# EAGLE design Circuito (EAGLE 8.2.0)
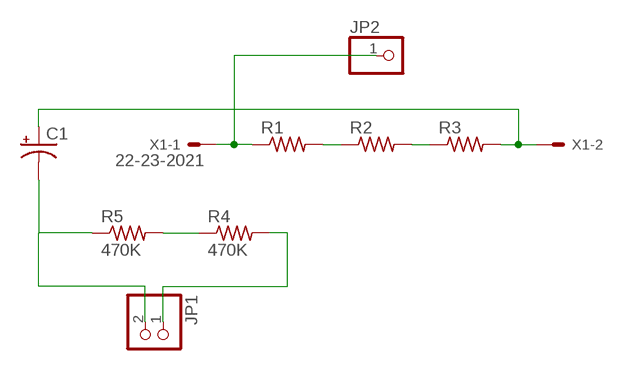
[diagram p0: schematic, sheet 1]

## Parts
C1  CPOL-USE2.5-7  [E2,5-7]
JP1  PINHD-1X2  [1X02]
JP2  PINHD-1X1  [1X01]
R1  R-US_0204/7  [0204/7]
R2  R-US_0204/7  [0204/7]
R3  R-US_0204/7  [0204/7]
R4  470K  R-US_0204/7  [0204/7]
R5  470K  R-US_0204/7  [0204/7]
X1  22-23-2021  [22-23-2021]

## Nets
N$1: C1.- JP1.2 R5.1
N$2: R4.1 R5.2
N$3: R1.2 R2.1
N$4: R2.2 R3.1
N$5: JP2.1 R1.1 X1.1
N$6: C1.+ R3.2 X1.2
N$9: JP1.1 R4.2

## Library data of the parts
C1 = rcl:CPOL-US: POLARIZED CAPACITOR, American symbol
JP1 = pinhead:PINHD-1X2: PIN HEADER
JP2 = pinhead:PINHD-1X1: PIN HEADER
R1-R3 = resistor:R-US_: RESISTOR, American symbol
R4 R5 = rcl:R-US_: RESISTOR, American symbol
X1 = con-molex:22-23-2021: .100" (2.54mm) Center Header - 2 Pin; MF: MOLEX; MPN: 22-23-2021; OC_FARNELL: 1462926; OC_NEWARK: 25C3832

## Board
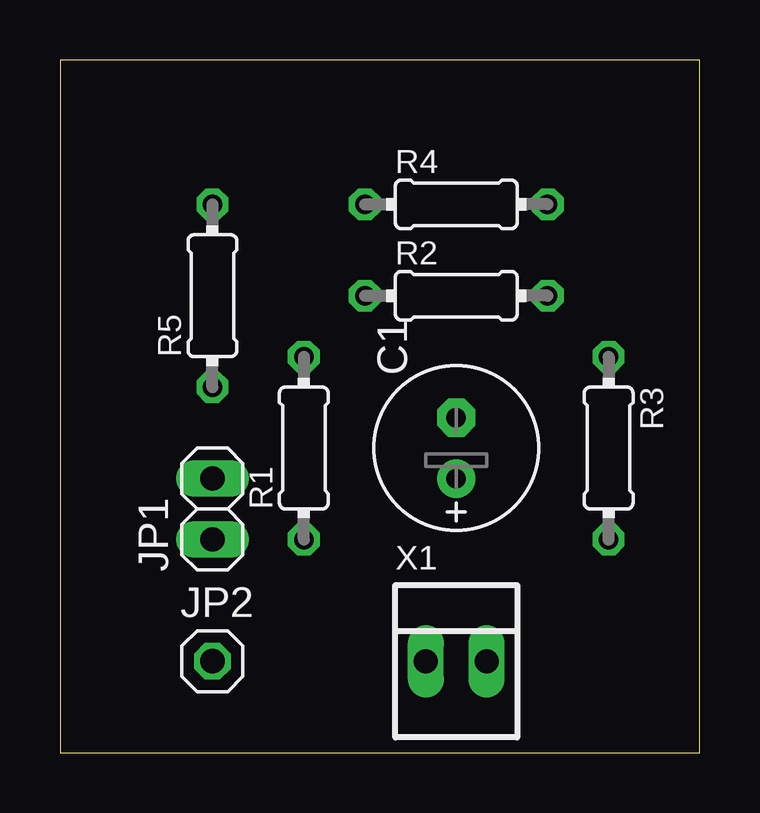
[diagram p1: board, top side]
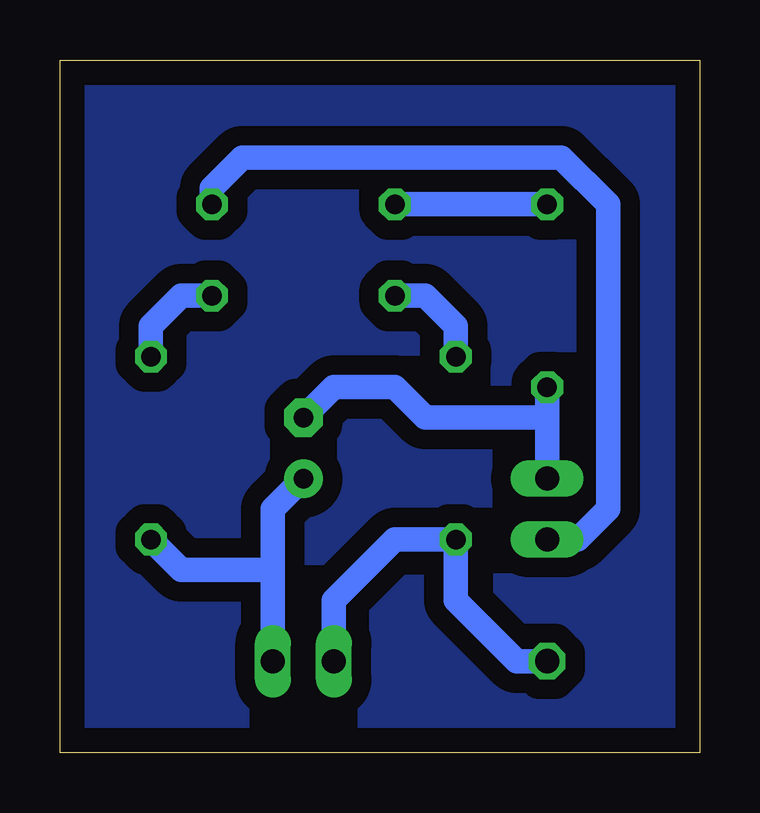
[diagram p2: board, bottom side, seen from below]

Size 26.65 x 28.88 mm. Coordinates in mm from the lower left corner, seen from the top.
Outline: 0,0 26.65,0 26.65,28.88 0,28.88 0,0
Copper layers (1*16): Top 0.035mm / dielectric 1.5mm / Bottom 0.035mm
Design rules "default": minimum track width 6mil, minimum drill 0.35mm, track to track 6mil, track to pad 6mil, pad to pad 6mil, via to via 6mil, smd to smd 6mil, copper to edge 40mil, drill to drill 6mil, minimum pad ring 10mil, minimum via ring 8mil, stop-mask expansion 4mil, vias tented up to drill 0mil, thermal gap 10mil

### Footprints (pad centres in the part's own frame; a part is rotated, then mirrored left to right if it is on the bottom)
E2,5-7 = drill 0.813 pad 1.6: + -1.27,0 | drill 0.813 pad 1.6 octagon: - 1.27,0
1X02 = drill 1.016 long: 1 -1.27,0; 2 1.27,0
1X01 = drill 1.016 octagon: 1 0,0
0204/7 = drill 0.813 octagon: 1 -3.81,0; 2 3.81,0
22-23-2021 = drill 1 long: 1 -1.27,0; 2 1.27,0

### Placement (x,y rotation side)
C1  16.51,12.7 90 top
JP1  6.35,10.16 90 top
JP2  6.35,3.81 0 top
R1  10.16,12.7 90 top
R2  16.51,19.05 0 top
R3  22.86,12.7 270 top
R4  16.51,22.86 0 top
R5  6.35,19.05 90 top
X1  16.51,3.81 0 top

### Tracks (layer width: path | path; a pad name or v marks a point on that pad's centre or on a via)
N$1
  Bottom 1.016: 6.35,13.97 R5.1 | 6.35,13.97 JP1.2 | C1.- 15.24,15.24 12.7,15.24 11.43,13.97 6.35,13.97
N$2
  Bottom 1.016: R5.2 R4.1
N$3
  Bottom 1.016: R2.1 11.43,19.05 10.16,17.78 R1.2
N$4
  Bottom 1.016: R2.2 21.59,19.05 22.86,17.78 R3.1
N$5
  Bottom 1.016: X1.1 15.24,6.35 12.7,8.89 R1.1 10.16,6.35 7.62,3.81 JP2.1
N$6
  Bottom 1.016: C1.+ 17.78,10.16 17.78,7.62 | 17.78,7.62 X1.2 | R3.2 21.59,7.62 17.78,7.62
N$7
  pour Bottom (isolate 0.813): 0,29.21 26.67,29.21 26.67,0 0,0
N$9
  Bottom 1.016: JP1.1 5.08,8.89 3.81,10.16 3.81,22.86 5.77,24.82 19.05,24.82 20.32,23.55 R4.2